# EAGLE design 2x6x1.27mm-pogo-adapter-flipped-mk-1.0.1 (EAGLE 9.2.2)
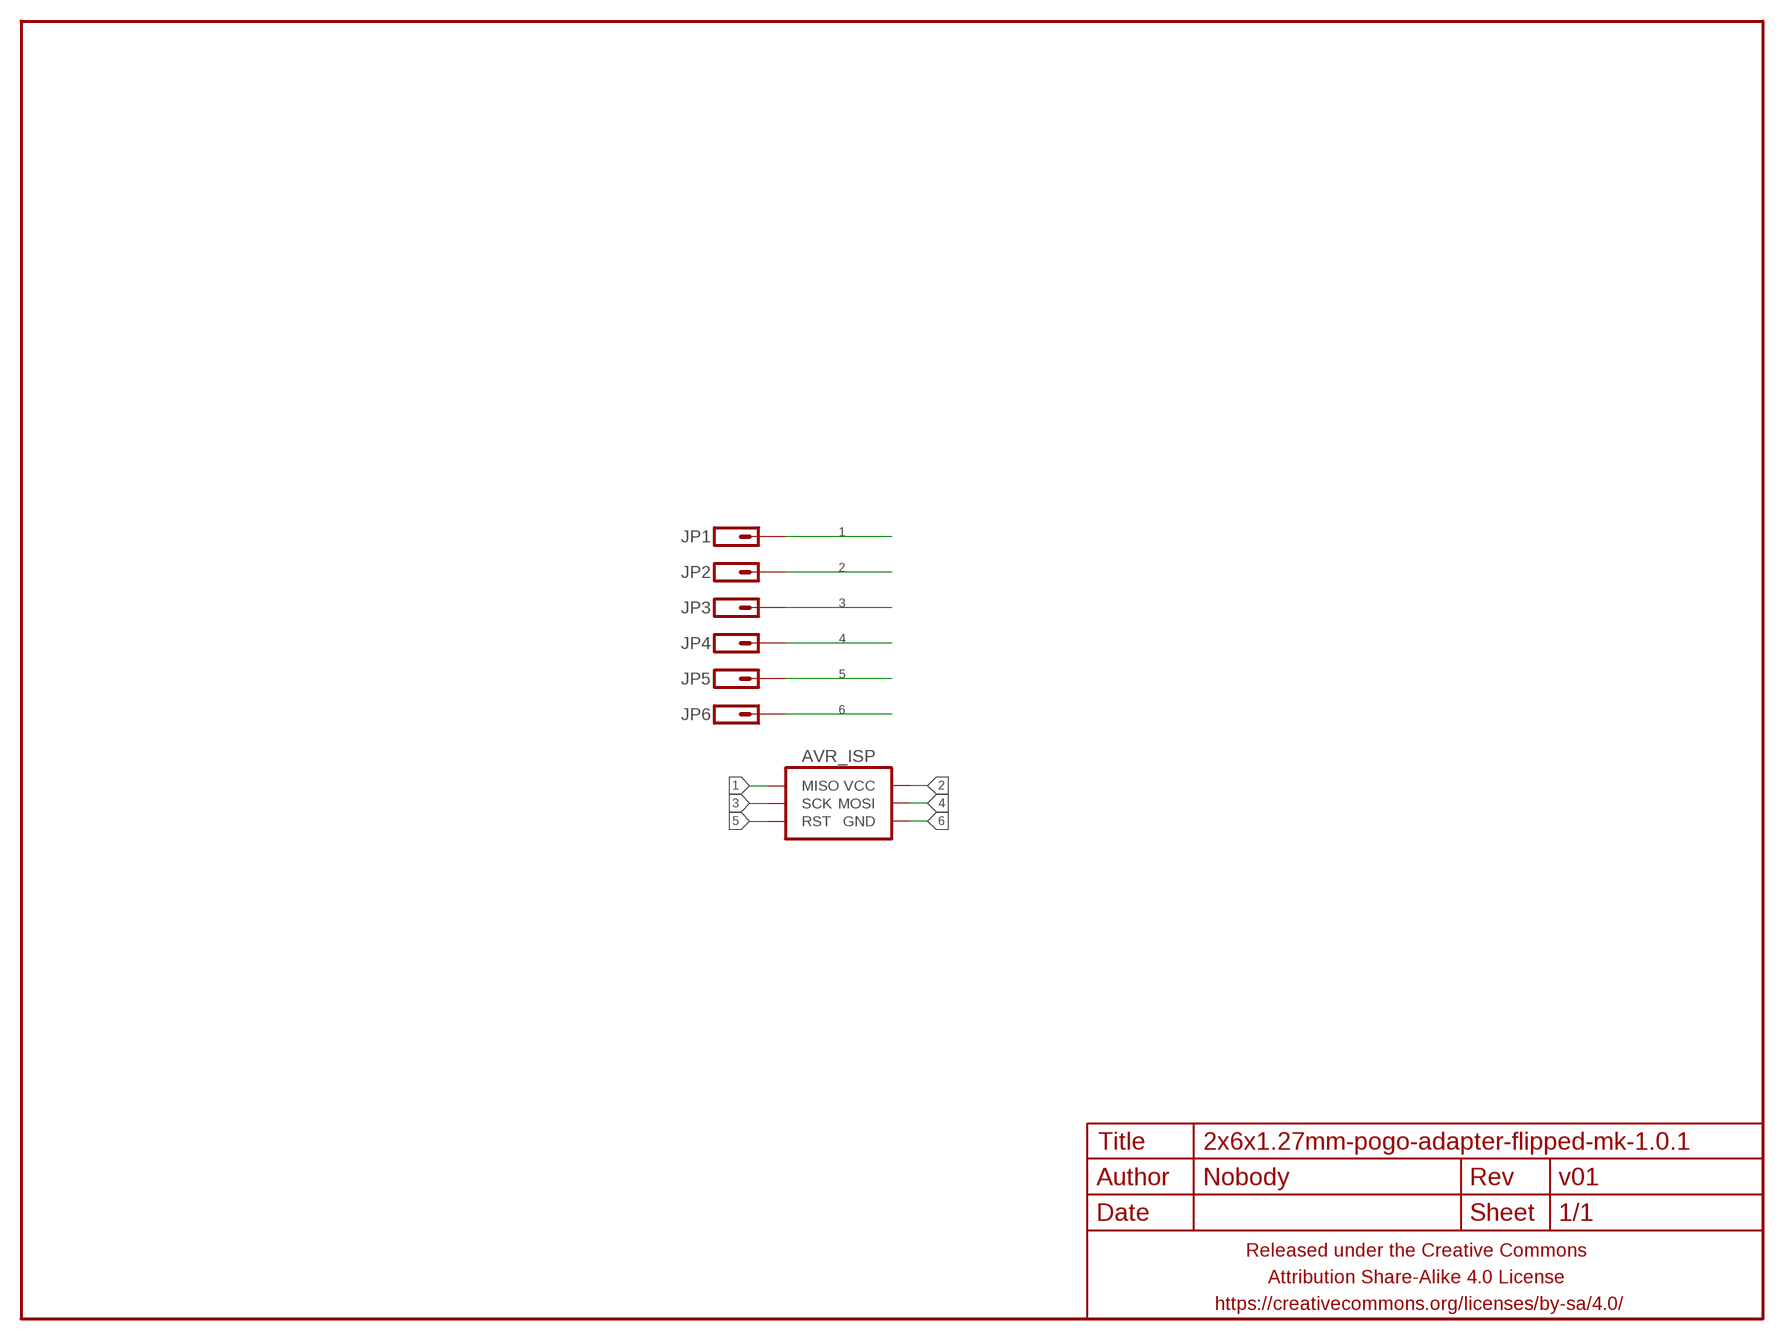
[diagram p0: schematic, sheet 1]

## Parts
AVR_ISP  AVR_SPI_PRG_62X3_SMD  [2X3_SMD]
FRAME1  FRAME-LETTERNO_PACKAGE  [DUMMY]
JP1  M01PTH-0.7MM-CIR-NS  [1X01-0.7MM-CIR-NS]
JP2  M01PTH-0.7MM-CIR-NS  [1X01-0.7MM-CIR-NS]
JP3  M01PTH-0.7MM-CIR-NS  [1X01-0.7MM-CIR-NS]
JP4  M01PTH-0.7MM-CIR-NS  [1X01-0.7MM-CIR-NS]
JP5  M01PTH-0.7MM-CIR-NS  [1X01-0.7MM-CIR-NS]
JP6  M01PTH-0.7MM-CIR-NS  [1X01-0.7MM-CIR-NS]

## Nets
1: AVR_ISP.1(MISO) JP1.P$1
2: AVR_ISP.2(VCC) JP2.P$1
3: AVR_ISP.3(SCK) JP3.P$1
4: AVR_ISP.4(MOSI) JP4.P$1
5: AVR_ISP.5(RST) JP5.P$1
6: AVR_ISP.6(GND) JP6.P$1

## Library data of the parts
AVR_ISP = a_parts:AVR_SPI_PRG_6: AVR ISP 6 Pin This is the reduced ISP connector for AVR programming. Common on Arduino. This footprint will take up less PCB space and can be used with a 10-pin to 6-pin adapter such as SKU: BOB-08508 **Special note about "TEST_POINT" package. The stop mask is on the top side, so if you want your programming test points to be on the bottom of your board, make sure to place this package on the bottom side of the board. This also ensure that the orientation to program from the bottom side will be correct.
FRAME1 = a_parts:FRAME-LETTER: Schematic Frame Standard 8.5x11 US Letter frame; DESIGNER: Nobody; VERSION: v01
JP1-JP6 = a_parts:M01: Header 1 Standard 1-pin 0.1" header. Use with straight break away headers (SKU : PRT-00116), right angle break away headers (PRT-00553), swiss pins (PRT-00743), machine pins (PRT-00117), and female headers (PRT-00115).

## Board
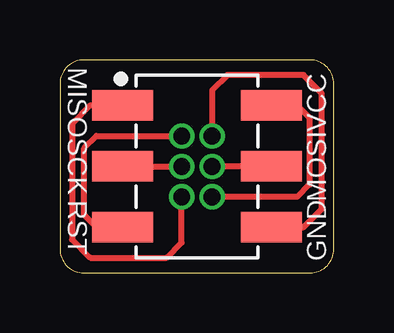
[diagram p1: board, top side]
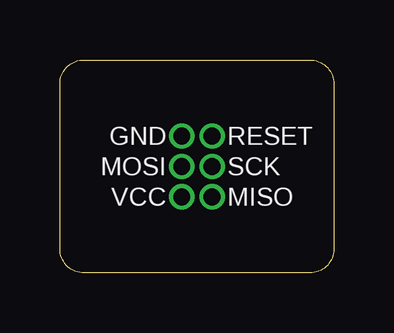
[diagram p2: board, bottom side, seen from below]

Size 11.43 x 8.89 mm. Coordinates in mm from the lower left corner, seen from the top.
Outline: 0,7.89 0,1 arc90 1,0 10.43,0 arc90 11.43,1 11.43,7.89 arc90 10.43,8.89 1,8.89 arc90 0,7.89
Copper layers (1*16): Top 0.0356mm / dielectric 1.5011mm / Bottom 0.0356mm
Design rules "LaenPCBOrder_2": minimum track width 6mil, minimum drill 13mil, track to track 6mil, track to pad 6mil, pad to pad 6mil, via to via 6mil, smd to smd 6mil, copper to edge 15mil, drill to drill 6mil, minimum pad ring 7mil, minimum via ring 7mil, stop-mask expansion 3mil, vias tented up to drill 20mil, thermal gap 10mil

### Footprints (pad centres in the part's own frame; a part is rotated, then mirrored left to right if it is on the bottom)
2X3_SMD = smd 1.27 x 2.54: 1 -2.54,-3.1; 2 -2.54,3.1; 3 0,-3.1; 4 0,3.1; 5 2.54,-3.1; 6 2.54,3.1
1X01-0.7MM-CIR-NS = drill 0.7: P$1 0,0

### Placement (x,y rotation side)
AVR_ISP  5.71,4.45 270 top
FRAME1  0,0 0 top
JP1  5.08,3.17 0 top
JP2  6.35,3.17 0 top
JP3  5.08,4.45 0 top
JP4  6.35,4.45 0 top
JP5  5.08,5.71 0 top
JP6  6.35,5.71 0 top

### Tracks (layer width: path | path; a pad name or v marks a point on that pad's centre or on a via)
1
  Top 0.254: AVR_ISP.1 1.27,6.99 0.51,6.22 0.51,1.4 1.27,0.64 4.45,0.64 5.08,1.27 JP1.P$1
2
  Top 0.254: AVR_ISP.2 9.91,6.99 10.41,6.48 10.41,3.68 9.91,3.17 JP2.P$1
3
  Top 0.254: AVR_ISP.3 JP3.P$1
4
  Top 0.254: AVR_ISP.4 JP4.P$1
5
  Top 0.254: AVR_ISP.5 1.52,1.91 1.02,2.41 1.02,5.21 1.52,5.71 JP5.P$1
6
  Top 0.254: AVR_ISP.6 10.16,1.91 10.92,2.67 10.92,7.49 10.16,8.26 6.99,8.26 6.35,7.62 JP6.P$1

### Text on the board
bPlace: RESET | GND | SCK | MOSI | MISO | VCC
tNames: MISO | VCC | SCK | MOSI | RST | GND